# EAGLE design interstage_B2 (EAGLE 9.6.0)
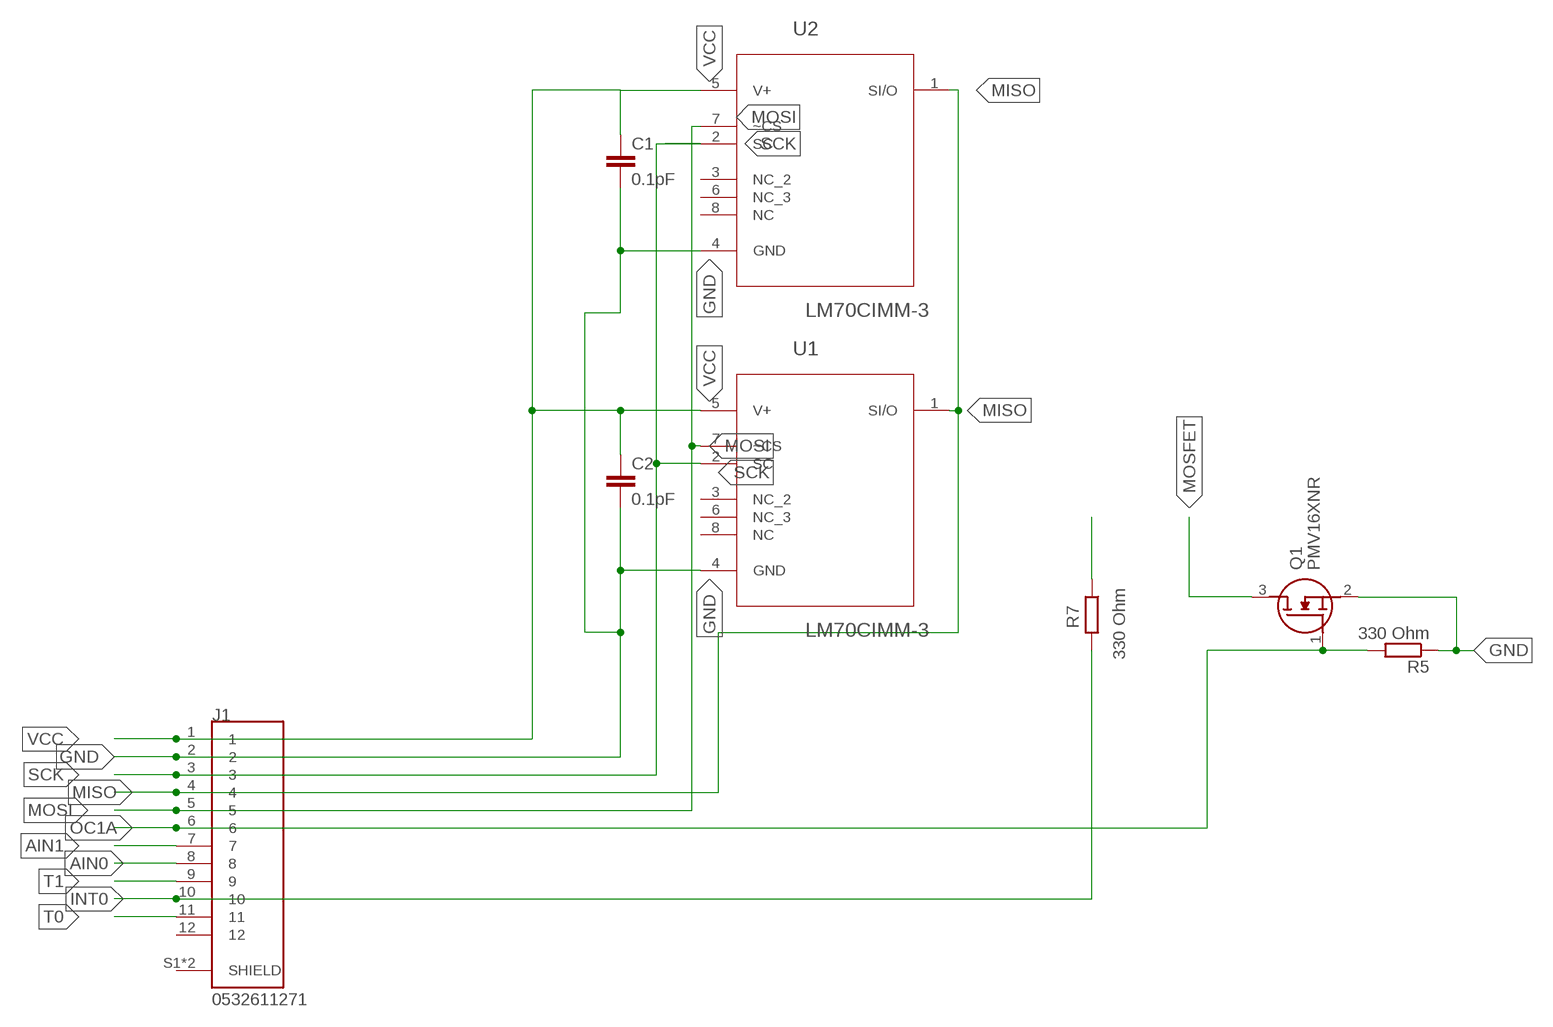
[diagram p0: schematic, sheet 1]

## Parts
C1  0.1pF  C-EUC0603K  [C0603K]
C2  0.1pF  C-EUC0603K  [C0603K]
J1  0532611271  [MOLEX_0532611271]
Q1  PMV16XNR  [SOT95P230X110-3N]
R5  330 Ohm  R-EU_R1206  [R1206]
R7  330 Ohm  R-EU_R1206  [R1206]
U1  LM70CIMM-3  [SOP65P490X110-8N]
U2  LM70CIMM-3  [SOP65P490X110-8N]

## Nets
AIN0: J1.8
AIN1: J1.7
GND: C1.2 C2.2 J1.2 Q1.2(S) R5.1 U1.4(GND) U2.4(GND)
INT0: J1.10 R7.2
MISO: J1.4 U1.1(SI/O) U2.1(SI/O)
MOSFET: Q1.3(D)
MOSI: J1.5 U1.7(~CS) U2.7(~CS)
N$1: R7.1
OC1A: J1.6 Q1.1(G) R5.2
SCK: J1.3 U1.2(SC) U2.2(SC)
T0: J1.11
T1: J1.9
VCC: C1.1 C2.1 J1.1 U1.5(V+) U2.5(V+)
Unconnected: J1.12 J1.S1(SHIELD) J1.S2(SHIELD) U1.3(NC_2) U1.6(NC_3) U1.8(NC) U2.3(NC_2) U2.6(NC_3) U2.8(NC)

## Library data of the parts
C1 C2 = rcl:C-EU: CAPACITOR, European symbol; SPICEPREFIX: C
J1 = picoblade:0532611271: Conn Shrouded Header HDR 12 POS 1.25mm Solder RA SMD PicoBlade; AVAILABILITY: Unavailable; DESCRIPTION: Picoblade Connector, 12 Circuit Single Row, Right Angle Surface Mount SMT PCB; MF: Molex; MP: 0532611271; PACKAGE: None; PRICE: None
Q1 = SamacSys_Parts:PMV16XNR: Nexperia PMV16XNR N-channel MOSFET, 8.6 A, 20 V PMV16XN, 3-Pin SOT-23 Source: Datasheet <https://componentsearchengine.com/Datasheets/1/PMV16XNR.pdf>; DESCRIPTION: Nexperia PMV16XNR N-channel MOSFET, 8.6 A, 20 V PMV16XN, 3-Pin SOT-23; HEIGHT: 1.1mm; MANUFACTURER_NAME: Nexperia; MANUFACTURER_PART_NUMBER: PMV16XNR; MOUSER_PART_NUMBER: 771-PMV16XNR; MOUSER_PRICE-STOCK: https://www.mouser.com/Search/Refine.aspx?Keyword=771-PMV16XNR
R5 R7 = rcl:R-EU_: RESISTOR, European symbol; SPICEPREFIX: R
U1 U2 = LM70CIMM-3:LM70CIMM-3: 10-Bit plus Sign Digital Temperature Sensor; AVAILABILITY: Unavailable; DESCRIPTION: Temperature Sensor Digital, Local -55°C ~ 150°C 10 b 8-VSSOP; MF: Texas Instruments; MP: LM70CIMM-3/NOPB; PACKAGE: MSOP-8 Texas Instruments; PRICE: None

## Board
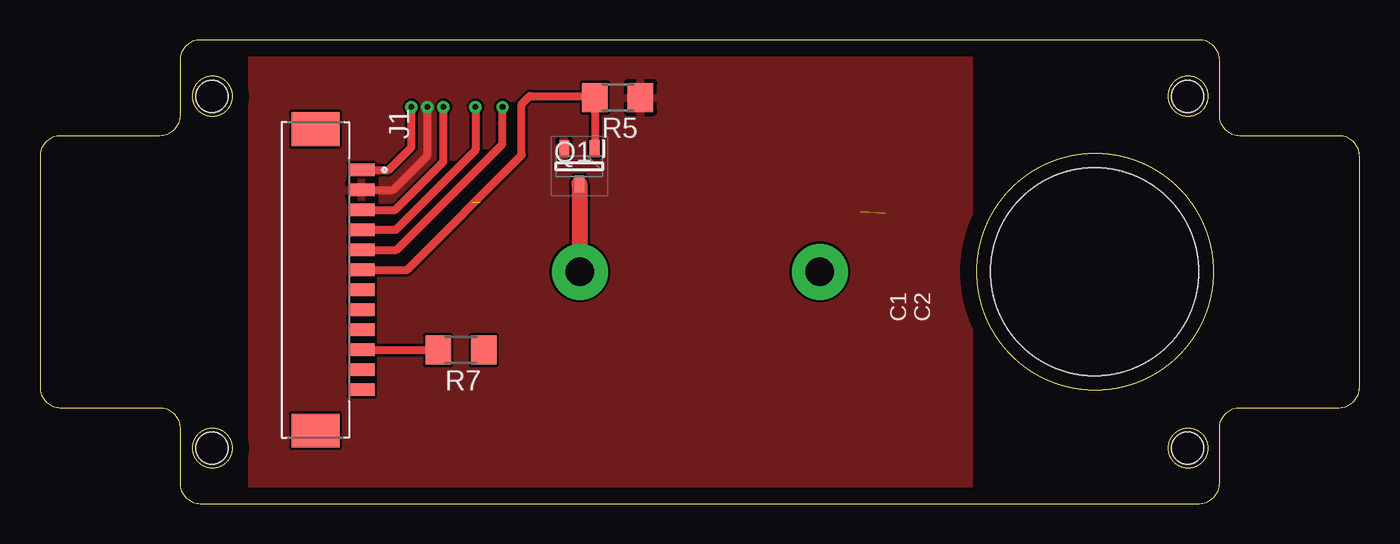
[diagram p1: board, top side]
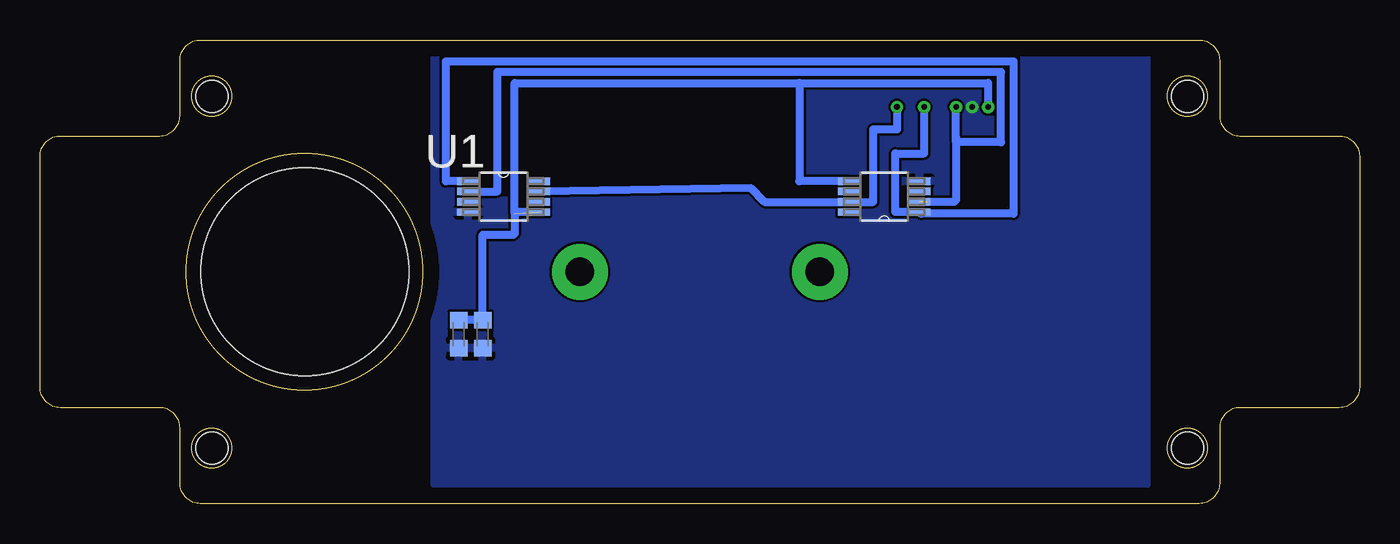
[diagram p2: board, bottom side, seen from below]

Size 82.5 x 29 mm. Coordinates in mm from the lower left corner, seen from the top.
Outline: 0,7.27 arc90 1.27,6 7.48,6 arc-90 8.75,4.73 8.75,1.27 arc90 10.02,0 72.48,0 arc90 73.75,1.27 73.75,4.73 arc-90 75.02,6 81.23,6 arc90 82.5,7.27 82.5,21.73 arc90 81.23,23 75.02,23 arc-90 73.75,24.27 73.75,27.73 arc90 72.48,29 10.02,29 arc90 8.75,27.73 8.75,24.27 arc-90 7.48,23 1.27,23 arc90 0,21.73 0,7.27
Outline: circle at 65.98,14.5 radius 7.4
Outline: circle at 71.78,25.48 radius 1.25
Outline: circle at 10.78,3.48 radius 1.25
Outline: circle at 10.78,25.48 radius 1.25
Outline: circle at 71.78,3.48 radius 1.25
Copper layers (1*16): Top 0.035mm / dielectric 1.5mm / Bottom 0.035mm
Design rules "default": minimum track width 6mil, minimum drill 0.35mm, track to track 6mil, track to pad 6mil, pad to pad 6mil, via to via 6mil, smd to smd 6mil, copper to edge 40mil, drill to drill 6mil, minimum pad ring 10mil, minimum via ring 8mil, stop-mask expansion 4mil, vias tented up to drill 0mil, thermal gap 10mil
Holes 2 mm at 10.75,3.48 10.75,25.48 71.75,3.48 71.75,25.48
Holes 13 mm at 65.95,14.5

### Footprints (pad centres in the part's own frame; a part is rotated, then mirrored left to right if it is on the bottom)
C0603K = smd 1.05 x 1.08: 1 -0.875,0; 2 0.875,0
MOLEX_0532611271 = smd 0.8 x 1.6: 1 -6.875,2.9; 2 -5.625,2.9; 3 -4.375,2.9; 4 -3.125,2.9; 5 -1.875,2.9; 6 -0.625,2.9; 7 0.625,2.9; 8 1.875,2.9; 9 3.125,2.9; 10 4.375,2.9; 11 5.625,2.9; 12 6.875,2.9 | smd 2.1 x 3: S1 -9.425,0; S2 9.425,0
SOT95P230X110-3N = smd 1.05 x 0.6: 1 -1.1,0.95; 2 -1.1,-0.95; 3 1.1,0
R1206 = smd 1.6 x 1.803: 1 -1.422,0; 2 1.422,0
SOP65P490X110-8N = smd 1.372 x 0.457: 1 -2.21,0.965; 2 -2.21,0.33; 3 -2.21,-0.33; 4 -2.21,-0.965; 5 2.21,-0.965; 6 2.21,-0.33; 7 2.21,0.33; 8 2.21,0.965

### Placement (x,y rotation side)
C1  54.82,10.6 270 bottom
C2  56.32,10.6 270 bottom
J1  17.22,14 270 top
Q1  33.72,21.1 270 top
R5  36.12,25.4 180 top
R7  26.32,9.6 180 top
U1  53.52,19.2 0 bottom
U2  29.72,19.2 180 bottom

### Tracks (layer width: path | path; a pad name or v marks a point on that pad's centre or on a via)
GND  (via drill 0.35)
  Top 0.5: v24.22,24.8 24.22,21.78 22.07,19.62 J1.2
  pour Bottom: 13.32,28.6 13.32,1.2 57.82,1.2 57.82,28.6
  pour Top: 13.22,28.43 13.22,1.2 13.12,1.1 58.12,1.1 58.12,28.43
INT0
  Top 0.5: J1.10 24.87,9.62 R7.2
MISO  (via drill 0.35)
  Top 0.5: J1.4 22.25,17.12 27.22,22.1 v27.22,24.8
  Bottom 0.5: U1.1 57.12,20.16 57.12,27.65 21.62,27.65 21.62,18.14 27.41,18.14 U2.1 29.02,18.23 29.02,21.9 27.22,21.9 v27.22,24.8
MOSFET  (via drill 1.8 pad 3.5)
  Top 1: v33.75,14.5 33.75,19.88 Q1.3
MOSI  (via drill 0.35)
  Top 0.5: J1.5 22.3,15.88 28.92,22.5 v28.92,24.8
  Bottom 0.5: U1.7 38.05,19.73 37.19,18.87 U2.7 30.42,18.87 30.42,23.4 28.92,23.4 v28.92,24.8
N$2  (via drill 1.8 pad 3.5)
  other vias: 48.75,14.5
OC1A
  Top 0.5: J1.6 22.95,14.62 30.12,21.8 30.12,25 30.62,25.5 34.4,25.5 34.6,25.3 R5.2 34.7,22.23 Q1.1
SCK  (via drill 0.35)  (1 unrouted)
  Top 0.5: J1.3 22.2,18.38 25.22,21.4 v25.22,24.8
  Bottom 0.5: 25.22,22.6 25.22,22.9 v25.22,24.8 | 25.22,22.6 22.42,22.6 22.42,27 53.92,27 53.92,19.53 U1.2 | 25.22,22.6 25.22,19 25.35,18.87 27.02,18.87
VCC  (via drill 0.35)  (1 unrouted)
  Top 0.5: v23.22,24.8 23.22,22.3 21.8,20.88 J1.1
  Bottom 0.5: 35.02,26.3 35.02,20.16 U2.5 | 35.02,26.3 23.22,26.3 v23.22,24.8 | 35.02,26.3 52.82,26.3 52.82,18.14 | C1.1 55.02,11.47 | 55.02,11.47 C2.1 | 54.55,11.75 C1.1 | U1.5 52.82,18.23 52.82,16.9 52.92,16.8 54.82,16.8 C1.1 | 54.99,11.5 55.02,11.47